# EasyEDA Pro project 自动增益.eprj

# Schematic Schematic1
Board Name: Board1; Create Date: 2025-04-30; Page Name: P1; Project Name: New Project_2025-04-30_13-32-50; Schematic Name: Schematic1; Update Date: 2025-06-08; Company: 嘉立创EDA; Page Size: A4; Version: V1.0
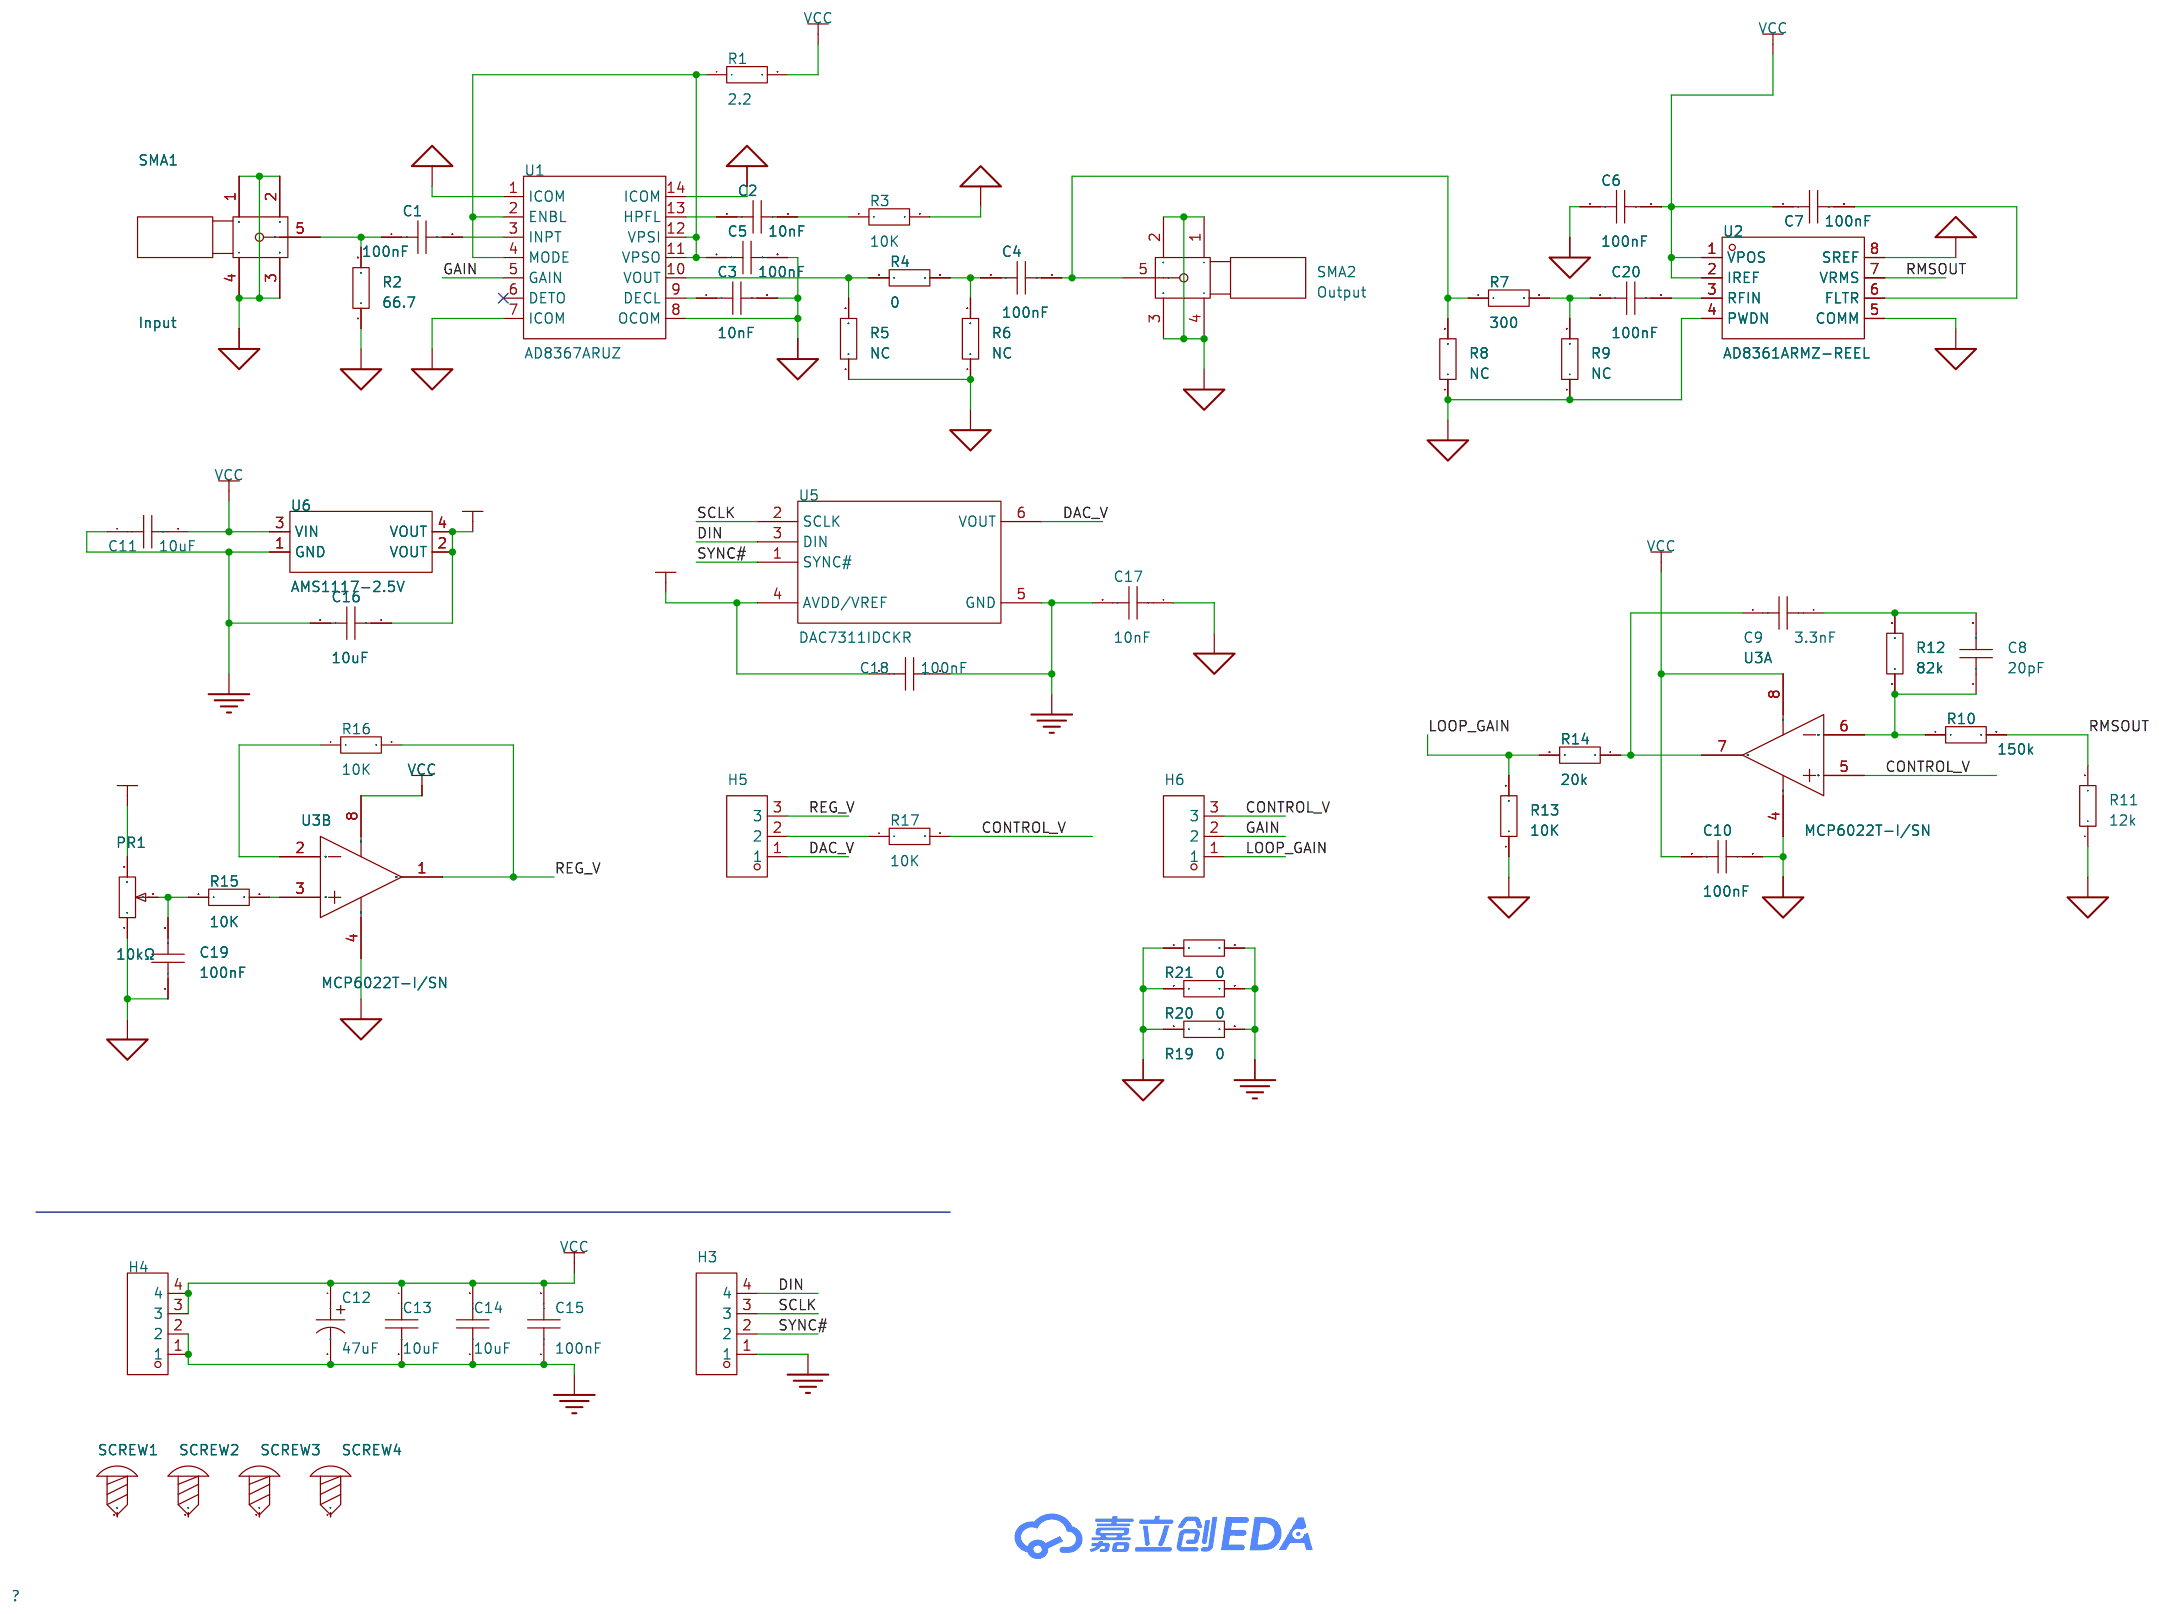
[diagram p0: schematic sheet]

## Parts
C1  100nF  [C0603]
C2  10nF  [C0603]
C3  10nF  [C0603]
C4  100nF  [C0603]
C5  100nF  [C0603]
C6  100nF  [C0603]
C7  100nF  [C0603]
C8  20pF  [C0603]
C9  3.3nF  [C0603]
C10  100nF  [C0603]
C11  10uF  [C0603]
C12  47uF  [CAP-SMD_BD6.3-L6.6-W6.6-LS7.3-FD]
C13  10uF  [C0603]
C14  10uF  [C0603]
C15  100nF  [C0603]
C16  10uF  [C0603]
C17  10nF  [C0603]
C18  100nF  [C0603]
C19  100nF  [C0603]
C20  100nF  [C0603]
H3  -  [HDR-TH_4P-P2.54-V-M]
H4  -  [HDR-TH_4P-P2.54-V-M]
H5  -  [HDR-TH_3P-P2.54-V-M]
H6  -  [HDR-TH_3P-P2.54-V-M]
PR1  10kΩ  [R_3296]
R1  2.2  [R0603]
R2  66.7  [R0603]
R3  10K  [R0603]
R4  0  [R0603]
R5  NC  [R0603]
R6  NC  [R0603]
R7  300  [R0603]
R8  NC  [R0603]
R9  NC  [R0603]
R10  150k  [R0603]
R11  12k  [R0603]
R12  82k  [R0603]
R13  10K  [R0603]
R14  20k  [R0603]
R15  10K  [R0603]
R16  10K  [R0603]
R17  10K  [R0603]
R19  0  [R0603]
R20  0  [R0603]
R21  0  [R0603]
SCREW1  -  [M3螺丝]
SCREW2  -  [M3螺丝]
SCREW3  -  [M3螺丝]
SCREW4  -  [M3螺丝]
SMA1  Input  [SMA-SMD_BWSMA-KE-P001]
SMA2  Output  [SMA-SMD_BWSMA-KE-P001]
U1  AD8367ARUZ  [TSSOP-14_L5.0-W4.4-P0.65-LS6.4-BL]
U2  AD8361ARMZ-REEL  [MSOP-8_L3.0-W3.0-P0.65-LS4.9-BL]
U3  MCP6022T-I/SN  [SOIC-8_L4.9-W3.9-P1.27-LS6.0-BL]  (sections 1,2)
U5  DAC7311IDCKR  [SOT-363_L2.0-W1.3-P0.65-LS2.1-BR]
U6  AMS1117-2.5V  [SOT-223_L6.5-W3.5-P2.30-LS7.0-BR]

## Library data of the parts
C1-C11 C13-C20 = CAP_0603: Supplier Footprint: 0603
C12 = SPT1CM470E05TRVZC: 容值:47uF;精度:±20%;额定电压:16V;类型:聚合物;; LCSC Part Name: 47uF ±20% 16V; Supplier Part: C41410186; Manufacturer: Yunxing(云星); Supplier Footprint: SMD,D6.3xL5mm; Datasheet: https://atta.szlcsc.com/upload/public/pdf/source/20240919/E10B786B053F2EF740092A8DAB1988C9.pdf; Supplier: LCSC; Tolerance: ±20%; Voltage Rated: 16V; Type: 聚合物; Diameter: 6.3mm; Height - Seated (Max): 5mm; Lifetime @ Temp: 2000hrs@105℃; Operating Temperature: -55℃~+105℃
H3 H4 = HDR-M_2.54_1x4P: Supplier Part: C492403; Supplier Footprint: 插件
H5 H6 = HDR-M_2.54_1x3P: Supplier Part: C2937625; Supplier Footprint: 插件
PR1 = R_3296: Supplier Footprint: 直插
R1-R17 R19-R21 = Res_0603: Supplier Footprint: 0603
SCREW1-SCREW4 = M3螺丝: Supplier Footprint: 插件
SMA1 SMA2 = SMA: Supplier Part: C9900018296; JLCPCB Part Class: 扩展库; Supplier: LCSC
U1 = AD8367ARUZ: 通道数:单路;带宽(-3db):500MHz;压摆率(SR):-;; LCSC Part Name: 500 MHz 、45dB线性dB可变增益放大器; Supplier Part: C578713; Manufacturer: ADI(亚德诺); Supplier Footprint: TSSOP-14; JLCPCB Part Class: 扩展库; Datasheet: https://atta.szlcsc.com/upload/public/pdf/source/20200408/C191561_25904AF254F64640D2A0ECFC6C3DB0D9.pdf; Supplier: LCSC; Number of Channels: 单路; -3dB Bandwidth: 500MHz; Current - Supply: 26mA
U2 = AD8361ARMZ-REEL: 应用领域:手机；W-CDMA；CDMA;频率范围:0MHz~2.5GHz;输入范围:-21dBm~5dBm;精度:±0.25dB;; LCSC Part Name: RMS 功率检测器; Supplier Part: C652747; Manufacturer: ADI(亚德诺); Supplier Footprint: MSOP-8; JLCPCB Part Class: 扩展库; Datasheet: https://atta.szlcsc.com/upload/public/pdf/source/20200408/C130107_5C4C2FB002E66DB882E0E5EE2445969B.pdf; Supplier: LCSC; Applications: 手机；W-CDMA；CDMA; Frequency Range: 0MHz~2.5GHz; Input Range: -21dBm~5dBm; Supply Voltage: 2.7V~5.5V; Supply Current: 1.1mA; Accuracy: ±0.25dB; Operating Temperature: -40℃~+85℃
U3 = MCP6022T-I/SN: 放大器数:双路;轨到轨:-;增益带宽积(GBP):-;输入失调电压(Vos):500uV;压摆率(SR):7V/us;输入偏置电流(Ib):1pA;; Supplier Part: C57639; Manufacturer: MICROCHIP(美国微芯); Supplier Footprint: SOIC-8; JLCPCB Part Class: 扩展库; Datasheet: https://atta.szlcsc.com/upload/public/pdf/source/20151020/1457707482040.pdf; Supplier: LCSC; Number of Channels: 双路; Maximum Power Supply Range (Vdd-Vss): 7V; Vos - Input Offset Voltage: 500uV; Input Offset Voltage Drift(Vos TC): 3.5uV/℃; Slew Rate: 7V/us; Ib - Input Bias Current: 1pA; Noise density(eN): 8.7nV/√Hz@10kHz; Common Mode Rejection Ratio(CMRR): 90dB; Operating Temperature: -40℃~+125℃; Single supply: 2.5V~5.5V
U5 = DAC7311IDCKR: 分辨率:12位;接口类型:SPI；QSPI;工作电压:2V~5.5V;稳定时间:9us;INL/DNL:1LSB;; Supplier Part: C128601; Manufacturer: TI(德州仪器); Supplier Footprint: SOT-363-6; JLCPCB Part Class: 扩展库; Datasheet: https://www.ti.com/cn/lit/gpn/dac6311; Supplier: LCSC; Resolution(Bits): 12位; Number of Channels: 1; Interface: SPI；QSPI; Voltage - Supply: 2V~5.5V; Settling Time: 9us; INL/DNL(LSB): 1LSB; Operating Temperature: -40℃~+125℃
U6 = AMS1117-2.5V_C5240656: 输出类型:固定;最大输入电压:18V;输出电压:2.5V;最大输出电流:1A;电源纹波抑制比(PSRR):60dB@(120Hz);输出极性:正极;; LCSC Part Name: 正 Vin=18V Vout=2.5V 1A 60dB@(120Hz); Supplier Part: C5240656; Manufacturer: MSKSEMI(美森科); Supplier Footprint: SOT-223; JLCPCB Part Class: 扩展库; Datasheet: https://atta.szlcsc.com/upload/public/pdf/source/20230802/7000FCAFF33971783A269E7BD69EFE08.pdf; Supplier: LCSC; Output Type: 固定; Maximum Input Voltage: 18V; Output Voltage: 2.5V; MAX Output Current: 1A; Power Supply Rejection Ratio (PSRR): 60dB@(120Hz); Dropout Voltage: 1.3V@(1A); Output Polarity: 正极

## Nets
2V5: C16.1 C18.1 PR1.3 U5.4(AVDD/VREF) U6.2(VOUT) U6.4(VOUT)
AGND: C3.2 C5.2 C6.1 C10.1 C17.1 C19.1 PR1.1 R2.1 R3.2 R5.1 R6.1 R8.1 R9.1 R11.1 R13.1 R19.1 R20.1 R21.1 SMA1.1 SMA1.2 SMA1.3 SMA1.4 SMA2.1 SMA2.2 SMA2.3 SMA2.4 U1.1(ICOM) U1.7(ICOM) U1.8(OCOM) U1.14(ICOM) U2.4(PWDN) U2.5(COMM) U2.8(SREF) U3.4(VSS)
GND: C11.1 C12.2 C13.2 C14.1 C15.1 C16.2 C17.2 C18.2 H3.1 H4.1 H4.2 R19.2 R20.2 R21.2 U5.5(GND) U6.1(GND)
VCC: C6.2 C7.1 C10.2 C11.2 C12.1 C13.1 C14.2 C15.2 H4.3 H4.4 R1.2 U2.1(VPOS) U2.2(IREF) U3.8(VDD) U6.3(VIN)
CONTROL_V: H6.3 R17.2 U3.5(VINB+)
DAC_V: H5.1 U5.6(VOUT)
DIN: H3.4 U5.3(DIN)
GAIN: H6.2 U1.5(GAIN)
LOOP_GAIN: H6.1 R13.2 R14.2
REG_V: H5.3 R16.2 U3.1(VOUTA)
RMSOUT: R10.2 R11.2 U2.7(VRMS)
SCLK: H3.3 U5.2(SCLK)
SYNC#: H3.2 U5.1(SYNC#)
$1N389: C5.1 R1.1 U1.2(ENBL) U1.4(MODE) U1.11(VPSO) U1.12(VPSI)
$1N456: C1.2 U1.3(INPT)
$1N508: C1.1 R2.2 SMA1.5
$1N802: C2.1 U1.13(HPFL)
$1N806: C2.2 R3.1
$1N858: C3.1 U1.9(DECL)
$1N1416: C7.2 U2.6(FLTR)
$1N1550: C4.1 R4.2 R6.2
$1N1564: R4.1 R5.2 U1.10(VOUT)
$1N1645: C4.2 R7.1 R8.2 SMA2.5
$1N1894: C20.1 R7.2 R9.2
$1N2232: C8.1 R10.1 R12.1 U3.6(VINB-)
$1N2323: C8.2 C9.1 R12.2
$1N2360: C9.2 R14.1 U3.7(VOUTB)
$1N4271: R16.1 U3.2(VINA-)
$1N4289: R15.2 U3.3(VINA+)
$1N4293: C19.2 PR1.2 R15.1
$1N4497: H5.2 R17.1
$1N8083: C20.2 U2.3(RFIN)

Not connected (* = marked no-connect by the designer): SCREW1 1; SCREW2 1; SCREW3 1; SCREW4 1; U1 6(DETO)*

# Board PCB1
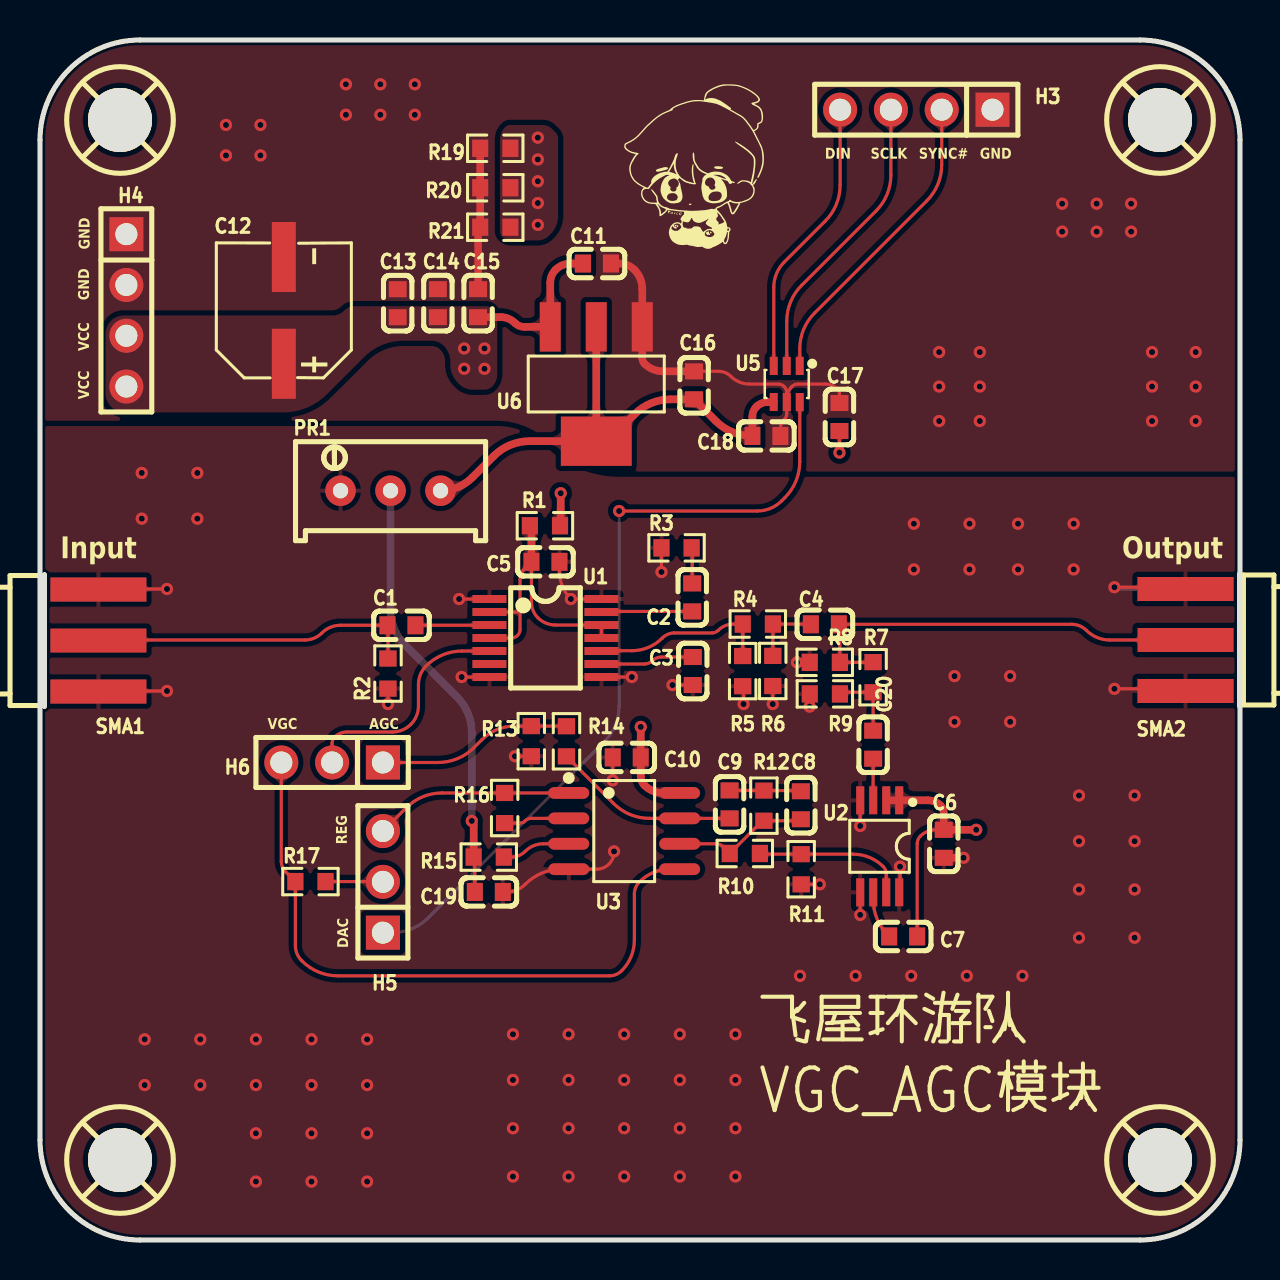
[diagram p1: board, top side]
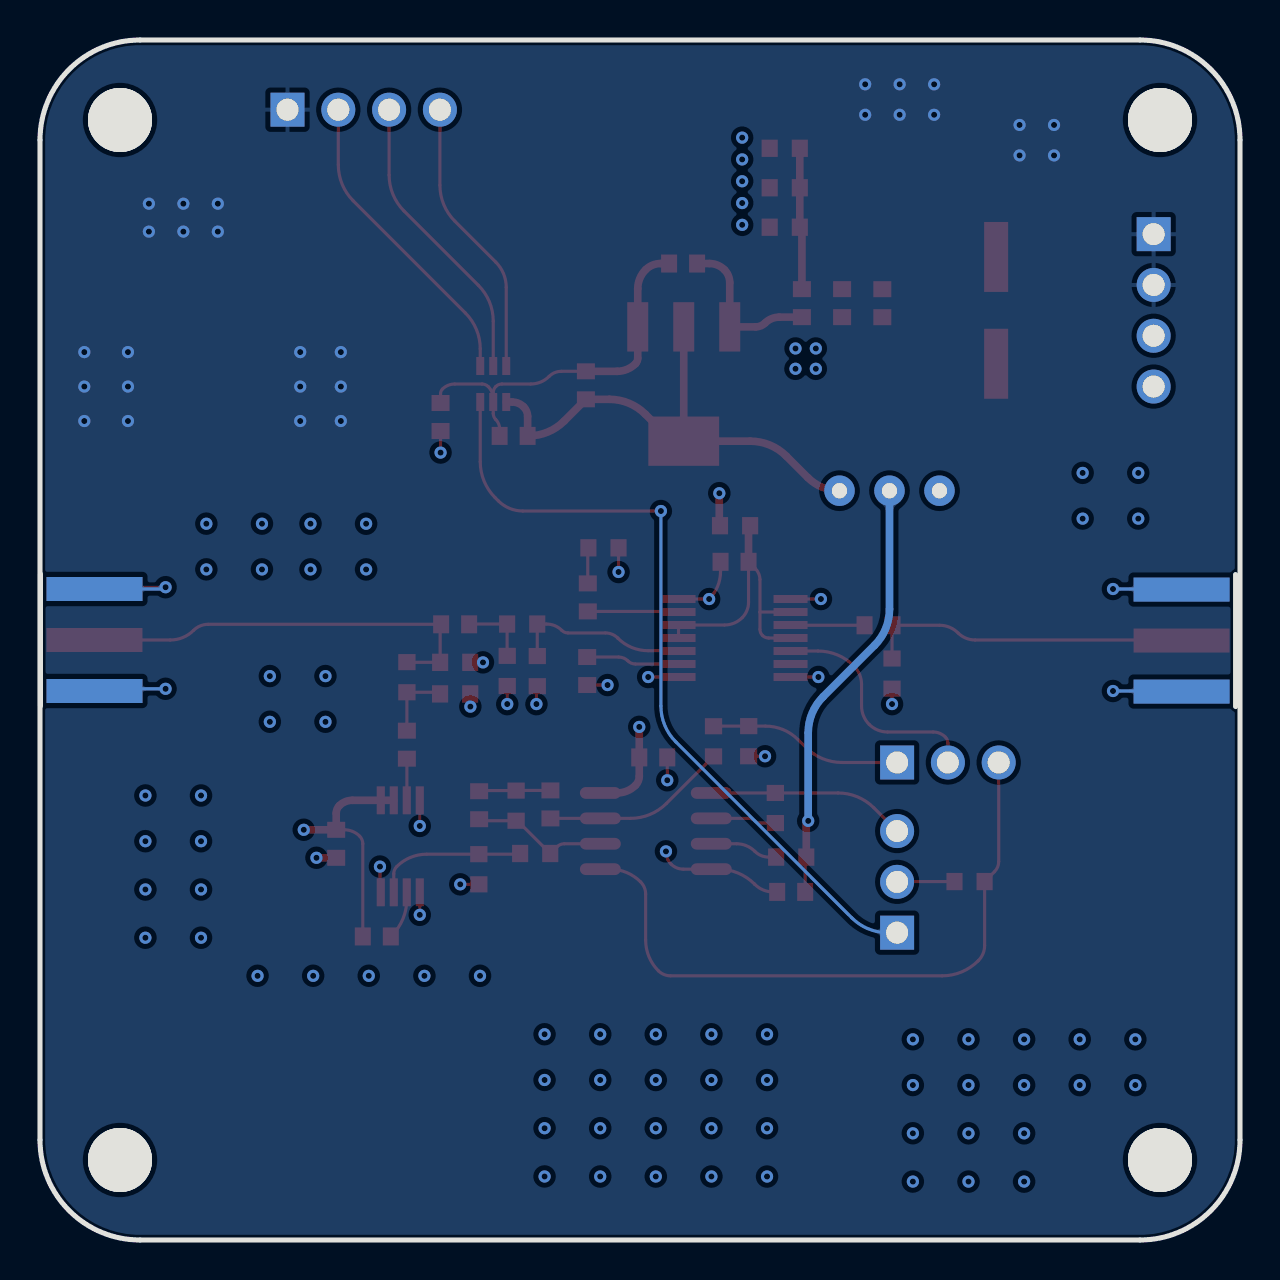
[diagram p2: board, bottom side, seen from below]

Outline 60 x 60 mm; copper layers: Top Layer, Inner1, Inner2, Bottom Layer. Coordinates in mm from the lower left corner of the outline.
Outline path: 0,55 0,5 arc(1.46,1.46) 5,0 55,0 arc(58.54,1.46) 60,5 60,55 arc(58.54,58.54) 55,60 5,60 arc(1.46,58.54) 0,55
Stack: Top Layer 0.035mm 外层铜厚1oz / Dielectric1 0.2104mm 7628 RC49% 8.6mil / Inner1 0.0152mm 内层铜厚 / Dielectric2 1.065mm 1.1mm H/HOZ Copper / Inner2 0.0152mm 内层铜厚 / Dielectric3 0.2104mm 7628 RC49% 8.6mil / Bottom Layer 0.035mm 外层铜厚1oz

## Design rules (mm)
template: 自定义配置
spacing copperThickness1oz (default): track to track 0.102, other pairs 0.152 to 0.3
spacing copperThickness2oz: track to track 0.203, other pairs 0.152 to 0.3
track width copperThickness1oz (default): min 0.127, default 0.254, max 2.54
track width copperThickness2oz: min 0.203, default 0.254, max 2.54
differential pair differentialPair (default): width min 0.127, default 0.254, max 2.54; gap min 0.152, default 0.152
via viaSize (default): diameter min 0.5, default 0.61, max 10; hole min 0.3, default 0.305, max 6.3
pour e195 uses power
pour e198 uses power
pour e328 uses power
pour e515 uses power
pour e589 uses power

## Placement (name value [footprint] x y rotation side)
C1  100nF  [C0603]  18.07 30.74 0 top
C2  10nF  [C0603]  32.61 32.13 90 top
C3  10nF  [C0603]  32.64 28.45 270 top
C4  100nF  [C0603]  39.24 30.78 0 top
C5  100nF  [C0603]  25.27 33.91 0 top
C6  100nF  [C0603]  45.19 19.81 90 top
C7  100nF  [C0603]  43.16 15.18 180 top
C8  20pF  [C0603]  38.04 21.74 90 top
C9  3.3nF  [C0603]  34.48 21.78 270 top
C10  100nF  [C0603]  29.34 24.13 0 top
C11  10uF  [C0603]  27.85 48.82 180 top
C12  47uF  [CAP-SMD_BD6.3-L6.6-W6.6-LS7.3-FD]  12.19 46.48 90 top
C13  10uF  [C0603]  17.88 46.84 90 top
C14  10uF  [C0603]  19.89 46.84 270 top
C15  100nF  [C0603]  21.9 46.84 270 top
C16  10uF  [C0603]  32.7 42.73 90 top
C17  10nF  [C0603]  39.97 41.15 90 top
C18  100nF  [C0603]  36.32 40.2 0 top
C19  100nF  [C0603]  22.44 17.4 180 top
C20  100nF  [C0603]  41.66 24.77 270 top
H3  -  [HDR-TH_4P-P2.54-V-M]  43.81 56.52 180 top
H4  -  [HDR-TH_4P-P2.54-V-M]  4.32 46.48 270 top
H5  -  [HDR-TH_3P-P2.54-V-M]  17.15 17.91 90 top
H6  -  [HDR-TH_3P-P2.54-V-M]  14.6 23.88 180 top
PR1  10kΩ  [R_3296]  17.53 37.59 0 top
R1  2.2  [R0603]  25.25 35.71 0 top
R2  66.7  [R0603]  17.4 28.32 90 top
R3  10K  [R0603]  31.83 34.61 180 top
R4  0  [R0603]  35.89 30.8 0 top
R5  NC  [R0603]  35.14 28.44 90 top
R6  NC  [R0603]  36.64 28.45 90 top
R7  300  [R0603]  41.65 28.14 270 top
R8  NC  [R0603]  39.24 28.88 0 top
R9  NC  [R0603]  39.24 27.31 0 top
R10  150k  [R0603]  35.24 19.33 0 top
R11  12k  [R0603]  38.06 18.54 90 top
R12  82k  [R0603]  36.19 21.72 90 top
R13  10K  [R0603]  24.56 24.94 90 top
R14  20k  [R0603]  26.32 24.93 90 top
R15  10K  [R0603]  22.44 19.15 0 top
R16  10K  [R0603]  23.23 21.6 90 top
R17  10K  [R0603]  13.52 17.92 180 top
R19  0  [R0603]  22.76 54.59 180 top
R20  0  [R0603]  22.76 52.61 180 top
R21  0  [R0603]  22.76 50.64 180 top
SCREW1  -  [M3螺丝]  4 4 0 top
SCREW2  -  [M3螺丝]  4 56 0 top
SCREW3  -  [M3螺丝]  56 4 0 top
SCREW4  -  [M3螺丝]  56 56 0 top
SMA1  Input  [SMA-SMD_BWSMA-KE-P001]  2.92 29.97 180 top
SMA2  Output  [SMA-SMD_BWSMA-KE-P001]  57.28 30 0 top
U1  AD8367ARUZ  [TSSOP-14_L5.0-W4.4-P0.65-LS6.4-BL]  25.27 30.1 270 top
U2  AD8361ARMZ-REEL  [MSOP-8_L3.0-W3.0-P0.65-LS4.9-BL]  41.99 19.69 180 top
U3  MCP6022T-I/SN  [SOIC-8_L4.9-W3.9-P1.27-LS6.0-BL]  29.21 20.45 270 top
U5  DAC7311IDCKR  [SOT-363_L2.0-W1.3-P0.65-LS2.1-BR]  37.34 42.8 90 top
U6  AMS1117-2.5V  [SOT-223_L6.5-W3.5-P2.30-LS7.0-BR]  27.81 42.8 90 top

## Footprints (pads in the part's own frame, mm; a bottom-side part is the same pattern mirrored in y, then rotated)
C0603
  rect 0.8x0.9 smd: 1(-0.7,0) 2(0.7,0)
CAP-SMD_BD6.3-L6.6-W6.6-LS7.3-FD
  rect 3.5x1.2 smd: 1(-2.67,0) 2(2.67,0)
HDR-TH_3P-P2.54-V-M
  rect 1.7x1.7 hole 1.1: 1(-2.54,0)
  round 1.7 hole 1.1: 2(0,0) 3(2.54,0)
HDR-TH_4P-P2.54-V-M
  rect 1.7x1.7 hole 1.1: 1(-3.81,0)
  round 1.7 hole 1.1: 2(-1.27,0) 3(1.27,0) 4(3.81,0)
M3螺丝
  round 3.2 hole 3.2: 1(0,0)
MSOP-8_L3.0-W3.0-P0.65-LS4.9-BL
  rect 0.406x1.397 smd: 1(-0.975,-2.3) 2(-0.325,-2.3) 3(0.325,-2.3) 4(0.975,-2.3) 5(0.975,2.3) 6(0.325,2.3) 7(-0.325,2.3) 8(-0.975,2.3)
R0603
  rect 0.806x0.864 smd: 1(-0.753,0) 2(0.753,0)
R_3296
  round 1.524 hole 0.762: 1(-2.499,-0.127) 2(0,-0.127) 3(2.499,-0.127)
SMA-SMD_BWSMA-KE-P001
  rect 4.8x1.2 smd: 1(0,-2.55) 2(0,2.55) 5(0,0)
  rect 4.8x1.2 smd far side: 3(0,2.55) 4(0,-2.55)
SOIC-8_L4.9-W3.9-P1.27-LS6.0-BL
  oval 0.588x2.045 smd: 1(-1.905,-2.772) 2(-0.635,-2.772) 3(0.635,-2.772) 4(1.905,-2.772) 5(1.905,2.772) 6(0.635,2.772) 7(-0.635,2.772) 8(-1.905,2.772)
SOT-223_L6.5-W3.5-P2.30-LS7.0-BR
  rect 2.465x1.05 smd: 1(2.857,-2.3) 2(2.857,0) 3(2.857,2.3)
  rect 2.465x3.54 smd: 4(-2.857,0)
SOT-363_L2.0-W1.3-P0.65-LS2.1-BR
  rect 0.9x0.4 smd: 1(0.9,-0.65) 2(0.9,0) 3(0.9,0.65) 4(-0.9,0.65) 5(-0.9,0) 6(-0.9,-0.65)
TSSOP-14_L5.0-W4.4-P0.65-LS6.4-BL
  rect 0.4x1.7 smd: 1(-1.95,-2.8) 2(-1.3,-2.8) 3(-0.65,-2.8) 4(0,-2.8) 5(0.65,-2.8) 6(1.3,-2.8) 7(1.95,-2.8) 8(1.95,2.8) 9(1.3,2.8) 10(0.65,2.8) 11(0,2.8) 12(-0.65,2.8) 13(-1.3,2.8) 14(-1.95,2.8)

## Nets
As in the schematic.

Pads without a net: SCREW1 1; SCREW2 1; SCREW3 1; SCREW4 1; U1 6

## Via types
v1: diameter 0.61, hole 0.305, Top Layer to Bottom Layer, 131 vias

## Routing (per net, layer and track width the routed paths; a pad name or vN(x,y) marks a point on that pad's centre or on a via; arc(x,y) is an arc through that point)
2V5: length 25.9
  Top Layer w0.381: U5.4 36.4,41.9 arc(36.08,41.84) 35.81,41.66 arc(35.67,41.44) 35.62,41.19 C18.1 35.59,40.2 arc(34.61,40.4) 33.79,40.95 C16.1 31.53,42.03 arc(30.56,41.84) 29.73,41.29 28.79,40.35 arc(28.34,40.05) U6.4 ; U6.2 U6.4 ; U6.4 24.48,39.94 arc(23.51,39.75) 22.69,39.2 21.61,38.12 arc(20.88,37.64) PR1.3
AGND: length 56.9
  Top Layer w0.158: R13.1 v1(23.75,24.19) ; C5.2 25.97,33.42 arc(26.12,32.68) v1(26.54,32.05) U1.14 ; v1(53.72,32.64) 57.06,32.64 arc(57.18,32.62) SMA2.2 ; U1.8 v1(29.59,28.15) ; U2.4 v1(41.01,20.7) ; R11.1 v1(38.99,17.78) ; U1.7 v1(21.08,28.15) ; 2.67,27.45 v1(6.35,27.45) ; v1(28.7,19.43) 28.7,19.41 arc(28.64,19.08) 28.45,18.8 arc(28.17,18.61) 27.84,18.54 U3.4 26.07,18.54 arc(25.1,18.35) 24.28,17.8 24.26,17.78 arc(23.84,17.5) 23.35,17.4 C19.1 ; v1(43,18.67) 43,17.48 arc(42.99,17.43) 42.96,17.39 ; R3.2 v1(31.07,33.4) ; R6.1 v1(36.64,26.8) ; 2.67,32.55 v1(6.35,32.55) ; C3.2 v1(31.62,27.75) ; C10.1 v1(28.64,22.99) ; U2.5 v1(41.01,16.26) ; U1.1 v1(20.96,32.05) ; C17.1 v1(39.97,39.37) ; v1(35.18,26.8) 35.18,27.59 arc(35.17,27.64) R5.1 ; R2.1 v1(17.4,26.8) ; v1(53.72,27.56) 57.01,27.56 arc(57.16,27.53) SMA2.1
  Top Layer w0.381: C6.1 v1(46.18,19.11)
  Bottom Layer w0.158: SMA2.2 53.94,32.55 arc(53.82,32.57) v1(53.72,32.64) ; v1(53.72,27.56) 57.01,27.56 arc(57.16,27.53) SMA2.1 ; 2.67,32.55 v1(6.35,32.55) ; 2.67,27.45 v1(6.35,27.45)
  vias: v1(5.09,38.35) v1(5.09,36.07) v1(5.23,10.03) v1(5.23,7.75) v1(7.87,38.35) v1(7.87,36.07) v1(8.01,10.03) v1(8.01,7.75) v1(10.79,10.03) v1(10.79,7.75) v1(10.79,5.33) v1(10.79,2.92) v1(13.58,10.03) v1(13.58,7.75) v1(13.58,5.33) v1(13.58,2.92) v1(16.36,10.03) v1(16.36,7.75) v1(16.36,5.33) v1(16.36,2.92) v1(23.65,10.29) v1(23.65,8) v1(23.65,5.59) v1(23.65,3.18) v1(24.89,55.12) v1(24.89,54.03) v1(24.89,52.94) v1(24.89,51.85) v1(24.89,50.76) v1(26.43,10.29) v1(26.43,8) v1(26.43,5.59) v1(26.43,3.18) v1(29.21,10.29) v1(29.21,8) v1(29.21,5.59) v1(29.21,3.18) v1(31.99,10.29) v1(31.99,8) v1(31.99,5.59) v1(31.99,3.18) v1(34.77,10.29) v1(34.77,8) v1(34.77,5.59) v1(34.77,3.18) v1(37.85,28.88) v1(38,13.21) v1(38.48,26.67) v1(40.78,13.21) v1(43.56,13.21) v1(43.69,35.81) v1(43.69,33.53) v1(45.73,28.19) v1(45.73,25.91) v1(46.34,13.21) v1(46.48,35.81) v1(46.48,33.53) v1(48.51,28.19) v1(48.51,25.91) v1(48.9,35.81) v1(48.9,33.53) v1(49.12,13.21) v1(51.68,35.81) v1(51.68,33.53) v1(51.95,22.22) v1(51.95,19.94) v1(51.95,17.53) v1(51.95,15.11) v1(54.73,22.22) v1(54.73,19.94) v1(54.73,17.53) v1(54.73,15.11)
GND: length 26.8
  Top Layer w0.158: 37.34,42.06 U5.5 37.34,41.33 arc(37.31,41.16) 37.21,41.02 arc(37.07,40.81) 37.02,40.56 37.02,40.2 ; 37.34,42.06 37.34,42.37 arc(37.3,42.53) 37.21,42.67 arc(37.07,42.77) 36.9,42.8 35.46,42.8 arc(34.97,42.9) 34.54,43.18 arc(34.26,43.37) 33.93,43.43 C16.2 ; 37.34,42.06 arc(37.4,42.39) 37.59,42.67 arc(37.73,42.77) 37.9,42.8 39.26,42.8 arc(39.6,42.73) 39.88,42.55 arc(39.95,42.44) 39.97,42.32 C17.2
  Top Layer w0.381: C16.2 31.15,43.43 arc(30.65,43.53) 30.23,43.81 arc(30.14,43.94) 30.11,44.09 U6.1 30.11,47.56 arc(30.01,48.08) 29.72,48.51 arc(29.38,48.74) 28.97,48.82 C11.1 ; R19.2 R20.2 R21.2 arc(21.93,50.52) 21.9,50.39 C15.1
  vias: v1(9.3,55.75) v1(9.3,54.23) v1(11.02,55.75) v1(11.02,54.23) v1(15.29,57.78) v1(15.29,56.26) v1(17.02,57.78) v1(17.02,56.26) v1(18.74,57.78) v1(18.74,56.26) v1(44.96,44.4) v1(44.96,42.67) v1(44.96,40.95) v1(46.99,44.4) v1(46.99,42.67) v1(46.99,40.95) v1(51.11,51.82) v1(51.11,50.42) v1(52.83,51.82) v1(52.83,50.42) v1(54.56,51.82) v1(54.56,50.42) v1(55.6,44.4) v1(55.6,42.67) v1(55.6,40.95) v1(57.78,44.4) v1(57.78,42.67) v1(57.78,40.95)
VCC: length 26.6
  Top Layer w0.158: C6.2 44.78,20.51 arc(44.37,20.43) 44.02,20.19 arc(43.9,20.02) 43.86,19.81 C7.1
  Top Layer w0.381: 42.31,21.98 44.39,21.98 arc(44.74,21.92) 45.03,21.72 arc(45.15,21.55) 45.19,21.34 C6.2 v1(46.81,20.51) ; U3.8 31.15,22.35 arc(30.65,22.45) 30.23,22.73 arc(30.09,22.94) 30.04,23.19 C10.2 v1(30.04,25.65) ; C11.2 26.53,48.82 arc(26.12,48.74) 25.78,48.51 arc(25.58,48.22) 25.51,47.87 U6.3 24.21,45.66 arc(23.96,45.71) 23.75,45.85 arc(23.42,46.07) 23.03,46.14 C15.2 ; v1(26.03,37.34) 26.03,35.8 arc(26.03,35.75) R1.2
  vias: v1(21.21,44.58) v1(21.21,43.56) v1(22.23,44.58) v1(22.23,43.56)
CONTROL_V: length 33.4
  Top Layer w0.158: U3.5 31.5,18.54 arc(30.68,18.38) 29.97,17.91 arc(29.78,17.63) 29.72,17.29 29.72,15 arc(29.55,14.17) 29.08,13.46 arc(28.8,13.27) 28.47,13.21 14.9,13.21 arc(13.92,13.4) 13.1,13.95 13.08,13.97 arc(12.85,14.32) 12.77,14.72 R17.2 12.28,18.41 arc(12.12,18.65) 12.06,18.92 H6.3
DAC_V: length 40.1
  Top Layer w0.158: U5.6 37.99,38.91 arc(37.79,37.94) 37.24,37.12 37.08,36.96 arc(36.52,36.58) 35.86,36.45 v1(28.96,36.45)
  Bottom Layer w0.158: 17.15,15.37 17.62,15.37 arc(18.59,15.56) 19.41,16.11 28.21,24.91 arc(28.76,25.73) 28.96,26.71 v1(28.96,36.45)
DIN: length 14
  Top Layer w0.158: U5.3 36.69,47.63 arc(36.82,48.32) 37.21,48.89 39.26,50.94 arc(39.81,51.77) 40,52.74 H3.4
GAIN: length 11.8
  Top Layer w0.158: H6.2 14.6,24.84 arc(14.64,25.01) 14.73,25.15 arc(15.01,25.33) 15.34,25.4 17.62,25.4 arc(18.12,25.5) 18.54,25.78 arc(18.82,26.2) 18.92,26.7 18.92,27.78 arc(19.02,28.28) 19.3,28.7 19.31,28.7 arc(20.13,29.26) 21.1,29.45 U1.5
LOOP_GAIN: length 9.7
  Top Layer w0.158: H6.1 19.9,23.88 arc(20.87,24.07) 21.7,24.62 22.1,25.02 arc(22.85,25.52) 23.73,25.69 R13.2 26.31,25.69 arc(26.32,25.69) R14.2
REG_V: length 10
  Top Layer w0.158: U3.1 R16.2 20.1,22.35 arc(19.13,22.16) 18.31,21.61 H5.3
RMSOUT: length 7.7
  Top Layer w0.158: 42.31,17.39 42.31,18.31 arc(42.27,18.51) 42.16,18.67 arc(41.48,19.13) 40.66,19.29 36.08,19.29 arc(36.03,19.3) R10.2
SCLK: length 14.8
  Top Layer w0.158: H3.3 42.54,53.25 arc(42.35,52.28) 41.8,51.45 38.08,47.73 arc(37.53,46.91) 37.34,45.94 U5.2
SYNC#: length 15.5
  Top Layer w0.158: H3.2 45.09,53.76 arc(44.89,52.79) 44.34,51.96 38.73,46.35 arc(38.18,45.53) 37.99,44.56 U5.1
$1N389: length 15.5
  Top Layer w0.158: 24,31.39 24,30.53 arc(23.97,30.37) 23.88,30.23 arc(23.74,30.13) 23.57,30.1 U1.4 ; 24,31.39 24,33.02 arc(24.06,33.31) 24.23,33.56 C5.1 24.57,31.89 arc(24.66,31.47) 24.89,31.11 arc(25.3,30.84) 25.78,30.75 28.07,30.75 U1.11 ; 24,31.39 arc(24,31.4) 23.99,31.4 U1.2
  Top Layer w0.381: C5.1 24.57,35.52 arc(24.55,35.63) R1.1
$1N456: length 3.7
  Top Layer w0.158: C1.2 22.44,30.74 arc(22.46,30.74) 22.47,30.75
$1N508: length 16.6
  Top Layer w0.158: 2.67,30 13.24,30 arc(13.71,30.09) 14.1,30.35 arc(14.52,30.64) 15.02,30.74 C1.1 arc(17.39,30.71) 17.4,30.68 R2.2
$1N802: length 4.5
  Top Layer w0.158: 32.61,31.43 28.15,31.43 arc(28.11,31.42) U1.13
$1N806: length 1.8
  Top Layer w0.158: C2.2 32.61,34.53 arc(32.6,34.57) R3.1
$1N858: length 4.7
  Top Layer w0.158: U1.9 30.23,28.8 arc(30.43,28.84) 30.61,28.96 arc(30.82,29.1) 31.07,29.15 C3.1
$1N1416: length 2.4
  Top Layer w0.158: C7.2 42.41,15.23 arc(41.85,16.06) 41.66,17.03 U2.6
$1N1550: length 3.5
  Top Layer w0.158: R6.2 arc(36.64,29.21) 36.64,29.22 R4.2 38.51,30.8 arc(38.53,30.79) C4.1
$1N1564: length 9
  Top Layer w0.158: 35.14,29.2 arc(35.14,29.2) 35.14,29.2 R4.1 34.68,30.8 arc(34.26,30.72) 33.91,30.48 arc(33.77,30.39) 33.6,30.35 31.73,30.35 arc(31.4,30.29) 31.12,30.1 31.11,30.09 arc(30.41,29.63) 29.59,29.46 28.11,29.46 arc(28.09,29.46) U1.10
$1N1645: length 21.1
  Top Layer w0.158: SMA2.5 53.48,30 arc(52.86,30.12) 52.32,30.48 arc(51.99,30.71) 51.59,30.78 39.94,30.78 arc(39.98,30.73) 39.99,30.67 R8.2 41.63,28.88 arc(41.64,28.89) R7.1
$1N1894: length 3.6
  Top Layer w0.158: C20.1 41.66,27.38 arc(41.66,27.38) R7.2 40.19,27.39 arc(40.09,27.37) R9.2
$1N2232: length 6.9
  Top Layer w0.158: U3.6 33.78,19.81 arc(33.98,19.77) 34.15,19.66 R10.1 36.08,20.92 arc(36.13,20.95) R12.1 37.86,20.96 arc(37.96,20.98) C8.1
$1N2323: length 3.6
  Top Layer w0.158: C9.1 36.17,22.48 arc(36.19,22.48) R12.2 37.97,22.47 arc(38.01,22.46) C8.2
$1N2360: length 9.3
  Top Layer w0.158: 26.32,24.18 28.68,21.83 arc(29.5,21.28) 30.48,21.08 U3.7 34.47,21.08 arc(34.48,21.08) C9.2
$1N4271: length 3.3
  Top Layer w0.158: U3.2 24.56,21.08 arc(24.4,21.05) 24.26,20.95 arc(24.14,20.87) 23.99,20.85 23.23,20.85
$1N4289: length 3.4
  Top Layer w0.158: R15.2 23.57,19.15 arc(23.94,19.22) 24.26,19.43 arc(24.68,19.71) 25.18,19.81 U3.3
$1N4293: length 21.6
  Top Layer w0.158: C19.2 21.74,19.01 arc(21.73,19.08) R15.1
  Top Layer w0.381: R15.1 21.69,20.73 arc(21.66,20.85) v1(21.59,20.95)
  Bottom Layer w0.381: v1(21.59,20.95) 21.59,25.36 arc(21.4,26.34) 20.85,27.16 18.27,29.74 arc(17.72,30.56) 17.53,31.53 PR1.2
$1N4497: length 2.9
  Top Layer w0.158: R17.1 17.11,17.92 arc(17.13,17.92) H5.2
$1N8083: length 2.1
  Top Layer w0.158: C20.2 41.66,22 arc(41.66,21.99) U2.3

## Copper pours and planes (outline as drawn; the poured copper is in the pictures)
AGND on Top Layer: 23.5,55.75 23.38,55.73 23.28,55.66 23.24,55.63 23.06,55.36 23,55.04 23,50.45 23.03,50.29 23.11,50.17 23.32,50.03 23.57,49.98 24.88,49.98 25.19,50.04 25.45,50.22 25.53,50.29 25.81,50.71 25.91,51.21 25.91,55.07 25.88,55.23 25.78,55.37 25.58,55.57 25.38,55.71 25.15,55.75
AGND on Top Layer: -6.35,63.37 65.28,63.37 65.28,-3.94 -6.35,-3.94
AGND on Inner1: -1.14,61.85 62.1,61.85 62.1,-2.03 -1.14,-2.03
GND on Top Layer: 3.94,51.82 3.67,51.76 3.45,51.61 3.4,51.56 3.04,51.03 2.92,50.41 2.92,48.04 3.02,47.54 3.3,47.12 3.72,46.83 4.22,46.74 11.38,46.74 11.54,46.77 11.82,46.96 11.99,46.99 22.29,46.99 22.47,47.02 22.61,47.12 22.7,47.25 22.73,47.41 22.73,48.01 22.69,48.24 22.55,48.44 22.48,48.51 22.06,48.8 21.56,48.89 18.25,48.89 17,49.14 15.95,49.85 15.19,50.6 14.69,50.94 14.1,51.05 7.93,51.05 7.76,51.09 6.92,51.65 6.09,51.82
GND on Top Layer: -4.25,44.64 -3.86,42.65 -2.73,40.96 22.85,40.96 24.26,40.68 25.46,39.88 27.07,38.8 28.98,38.42 60.53,38.42 61.69,38.65 62.67,39.31 62.67,57.62 62.21,59.94 60.9,61.91 13.61,61.91 12.95,61.78 12.38,61.4 8.32,61.4 1.51,60.05 -4.25,56.2
GND on Bottom Layer: -5.33,62.1 63.75,62.1 63.75,-0.13 -5.33,-0.13
VCC on Top Layer: 3.35,45.67 3.28,45.3 3.28,42.33 3.35,41.96 3.56,41.66 3.86,41.45 4.23,41.38 12.15,41.38 13.34,41.61 14.35,42.29 16.21,44.15 17.11,44.75 18.16,44.96 21.99,44.96 22.32,45.02 22.61,45.21 22.79,45.49 22.86,45.83 22.86,45.97 22.8,46.29 22.61,46.56 22.47,46.66 22.3,46.69 15.73,46.69 15.46,46.64 14.94,46.29 14.61,46.23 4.17,46.23 3.84,46.16 3.56,45.97
VCC on Top Layer: 19.56,44.96 19.58,44.96 19.91,44.89 20.19,44.7 20.43,44.35 20.51,43.93 20.51,43.76 20.61,43.28 20.88,42.88 20.96,42.8 21.27,42.59 21.65,42.51 22.22,42.51 22.43,42.55 22.61,42.67 22.79,42.95 22.86,43.28 22.86,45.85 22.62,45.85 22.23,45.92 21.9,46.14 20.83,45.93 19.92,45.32
VCC on Inner2: -2.41,61.5 62.1,61.5 62.1,-1.4 -2.41,-1.4

Small or netless copper shapes (teardrops, artwork), in the pictures only: 185 on Top Layer, 12 on Bottom Layer

## Text on the board
Top Silkscreen Layer: DIN | SCLK | SYNC# | GND | VCC | REG | DAC | VGC | AGC | Input | Output | 飞屋环游队 / VGC_AGC模块
